# EAGLE design Mono Audio Amp (TPA2005D1) v10 (EAGLE 6.1)
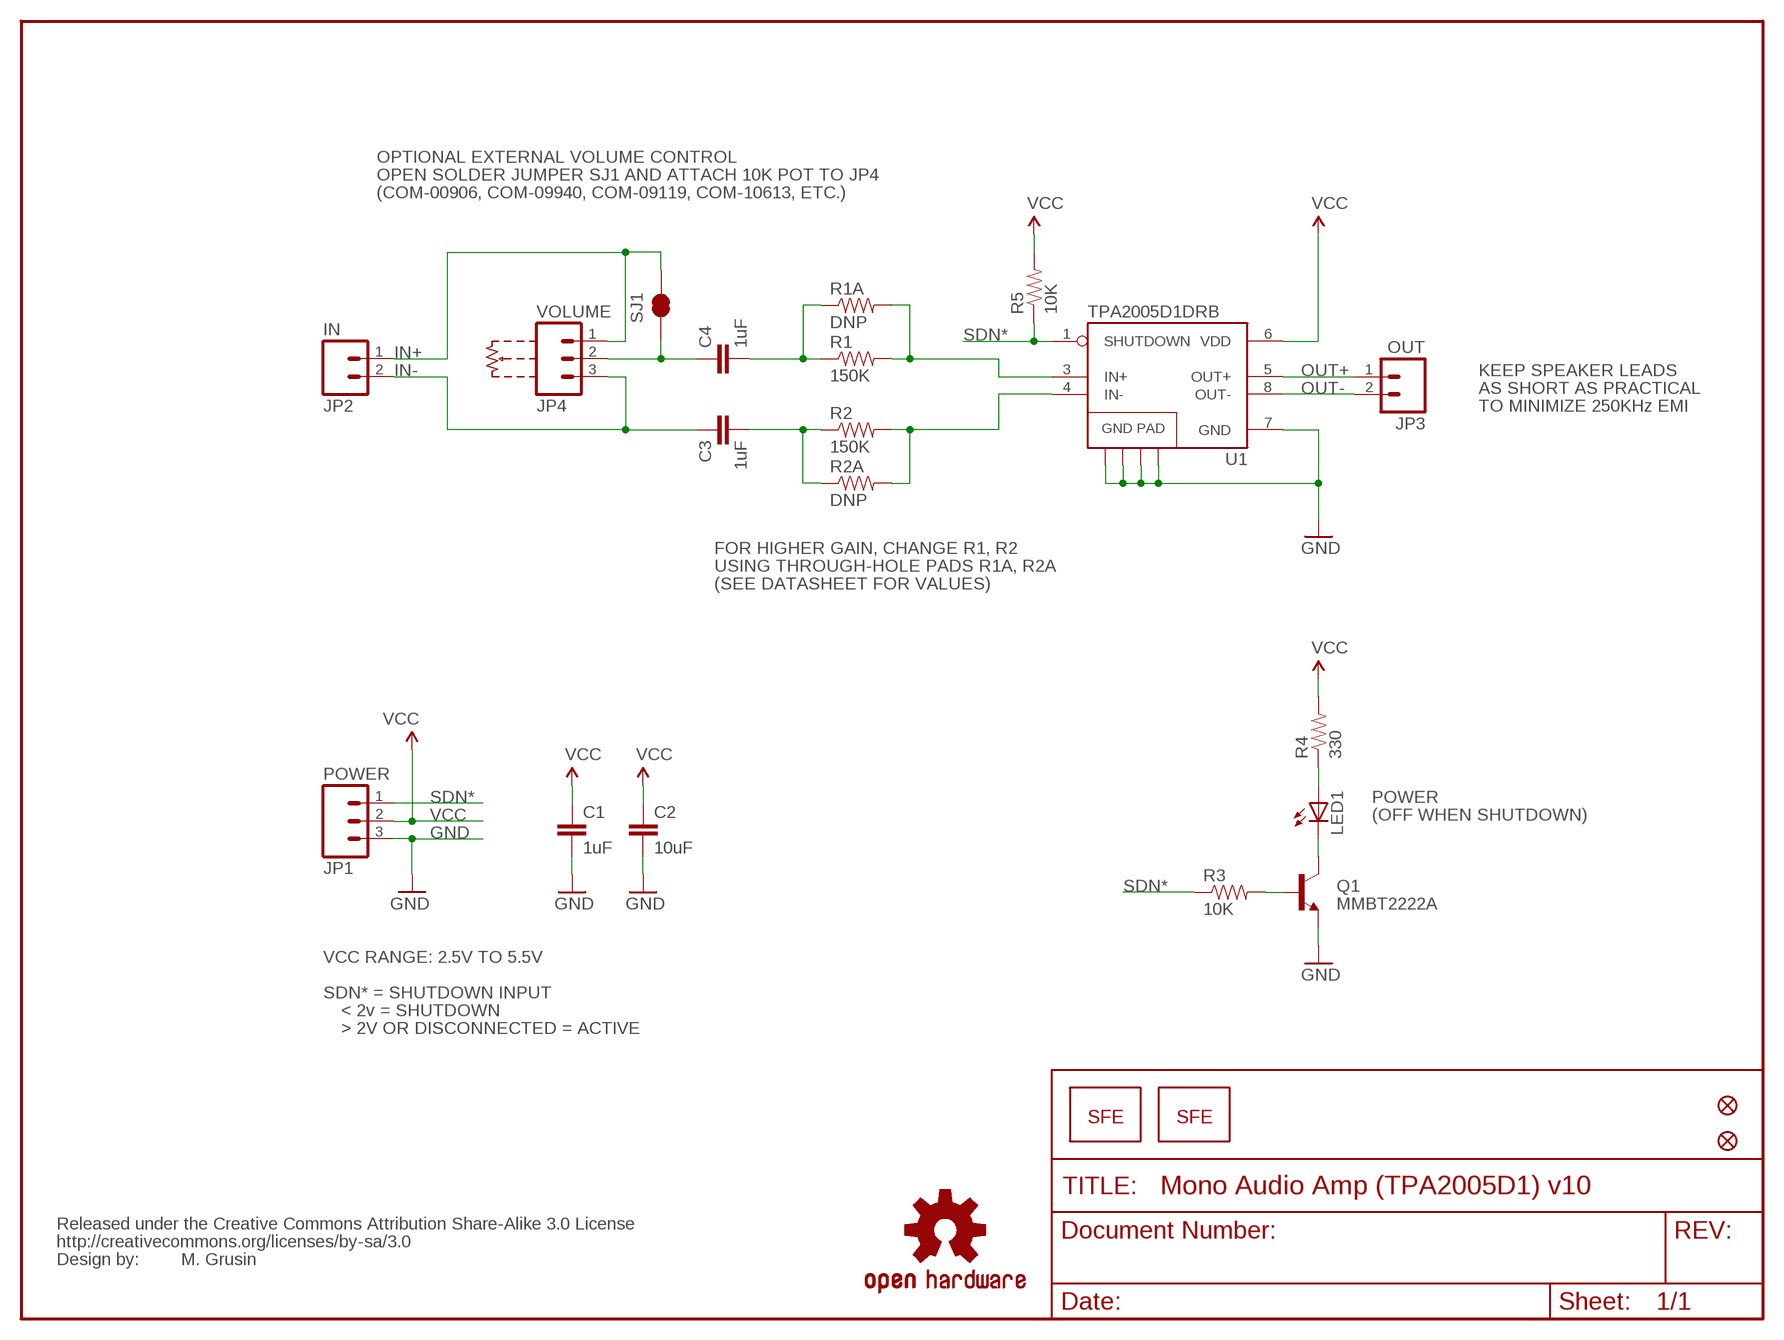
[diagram p0: schematic, sheet 1]

## Parts
C1  1uF  CAP1206  [1206]
C2  10uF  CAP1206  [1206]
C3  1uF  CAP1206  [1206]
C4  1uF  CAP1206  [1206]
JP1  POWER  M03PTH  [1X03]
JP2  IN  M02PTH  [1X02]
JP3  OUT  M02PTH  [1X02]
JP4  VOLUME  M03PTH  [1X03]
JP5  FIDUCIALUFIDUCIAL  [MICRO-FIDUCIAL]
JP6  FIDUCIALUFIDUCIAL  [MICRO-FIDUCIAL]
LED1  LED0603  [LED-0603]
LOGO1  LOGO-SFENW2  [SFE-NEW-WEB]
LOGO2  LOGO-SFESK  [SFE-LOGO-FLAME]
Q1  MMBT2222A  TRANSISTOR_NPNSOT23-3  [SOT23-3]
R1  150K  RESISTOR0603-RES  [0603-RES]
R1A  DNP  RESISTORAXIAL-0.3  [AXIAL-0.3]
R2  150K  RESISTOR0603-RES  [0603-RES]
R2A  DNP  RESISTORAXIAL-0.3  [AXIAL-0.3]
R3  10K  RESISTOR0603-RES  [0603-RES]
R4  330  RESISTOR0603-RES  [0603-RES]
R5  10K  RESISTOR0603-RES  [0603-RES]
SJ1  SOLDERJUMPERNC2  [SJ_2S-NOTRACE]
U1  TPA2005D1DRB  [QFN-8_PAD]
U$1  CREATIVE_COMMONS  [CREATIVE_COMMONS]
U$2  OSHW-LOGOS  [OSHW-LOGO-S]

## Nets
GND: C1.2 C2.2 JP1.3 Q1.2(E) U1.7(GND) U1.10(GND) U1.11(GND) U1.12(GND) U1.13(GND)
IN+: JP2.1 JP4.1 SJ1.2
IN+AMP: R1.2 R1A.P$2 U1.3(IN+)
IN-: C3.1 JP2.2 JP4.3
IN-AMP: R2.2 R2A.P$2 U1.4(IN-)
N$1: C4.1 JP4.2 SJ1.1
N$2: C4.2 R1.1 R1A.P$1
N$3: C3.2 R2.1 R2A.P$1
N$8: LED1.C Q1.3(C)
N$9: LED1.A R4.1
N$10: Q1.1(B) R3.2
OUT+: JP3.1 U1.5(OUT+)
OUT-: JP3.2 U1.8(OUT-)
SDN*: JP1.1 R3.1 R5.1 U1.1(SHUTDOWN)
VCC: C1.1 C2.1 JP1.2 R4.2 R5.2 U1.6(VDD)

## Notes on the sheet
- OPTIONAL EXTERNAL VOLUME CONTROL
- OPEN SOLDER JUMPER SJ1 AND ATTACH 10K POT TO JP4
- (COM-00906, COM-09940, COM-09119, COM-10613, ETC.)
- KEEP SPEAKER LEADS
- AS SHORT AS PRACTICAL
- TO MINIMIZE 250KHz EMI
- FOR HIGHER GAIN, CHANGE R1, R2
- USING THROUGH-HOLE PADS R1A, R2A
- (SEE DATASHEET FOR VALUES)
- POWER
- (OFF WHEN SHUTDOWN)
- VCC RANGE: 2.5V TO 5.5V
- SDN* = SHUTDOWN INPUT
- < 2v = SHUTDOWN
- > 2V OR DISCONNECTED = ACTIVE
- M. Grusin

## Library data of the parts
C1-C4 = SparkFun:CAP: Capacitor Standard 0603 ceramic capacitor, and 0.1" leaded capacitor.
JP1 JP4 = SparkFun:M03: Header 3 Standard 3-pin 0.1" header. Use with straight break away headers (SKU : PRT-00116), right angle break away headers (PRT-00553), swiss pins (PRT-00743), machine pins (PRT-00117), and female headers (PRT-00115). Molex polarized connector foot print use with SKU : PRT-08232 with associated crimp pins and housings.
JP2 JP3 = SparkFun:M02: Header 2 Standard 2-pin 0.1" header. Use with straight break away headers (SKU : PRT-00116), right angle break away headers (PRT-00553), swiss pins (PRT-00743), machine pins (PRT-00117), and female headers (PRT-00115). Molex polarized connector foot print use with SKU : PRT-08233 with associated crimp pins and housings.
JP5 JP6 = SparkFun:FIDUCIAL: Fiducial Alignment Points Various fiducial points for machine vision alignment.
LED1 = SparkFun:LED: LEDs Standard schematic elements and footprints for 5mm, 3mm, 1206, and 0603 sized LEDs. 5mm - Spark Fun Electronics SKU : COM-00529 (and others)
LOGO1 LOGO2 = SparkFun:LOGO-SFE: Spark Fun Electronics PCB Logo This is the standard Spark Fun Electronics PCB logo.
Q1 = SparkFun:TRANSISTOR_NPN: Transistor NPN BJT configuration in SOT23 package. MMBT2222 is the common NPN we use. Double check BCE configuration again layout.
R1 R1A R2 R2A R3-R5 = SparkFun:RESISTOR: Resistor Basic schematic elements and footprints for 0603, 1206, and PTH resistors.
SJ1 = SparkFun:SOLDERJUMPER: Solder Jumper Standard SMD solder jumper. Used to automate production. Two varients : Normally Open and Normally Closed are the same, but have different paste layers. NC will have a large amount of paste and should jumper during reflow.
U1 = mike-temp:TPA2005D1: 1.4W MONO CLASS-D AUDIO POWER AMPLIFIER The TPA2005D1 is a 1.4-W high efficiency filter-free class-D audio power amplifier in a BGA, QFN, or MSOP package that requires only three external components. Datasheet: http://focus.ti.com/lit/ds/symlink/tpa2005d1.pdf 1.4 W Into 8 ? From a 5V Supply at THD = 10% (Typ) Maximum Battery Life and Minimum Heat Efficiency With an 8-? Speaker: 84% at 400 mW, 79% at 100 mW 2.8-mA Quiescent Current 0.5-mA Shutdown Current Ideal for Wireless or Cellular Handsets and PDAs Capable of Driving an 8-? Speaker (2.5 V ? VDD ? 5.5 V) and a 4-? Speaker (2.5 V ? VDD ? 4.2 V) Only Three External Components Optimized PWM Output Stage Eliminates LC Output Filter Internally Generated 250-kHz Switching Frequency Eliminates Capacitor and Resistor Improved PSRR (-71 dB at 217 Hz) and Wide Supply Voltage (2.5 V to 5.5 V) Eliminates Need for a Voltage Regulator Fully Differential Design Reduces RF Rectification and Eliminates Bypass Capacitor Improved CMRR Eliminates Two Input Coupling Capacitors
U$1 = SparkFun:CREATIVE_COMMONS
U$2 = SparkFun:OSHW-LOGO: Open Source Hardware Logo This logo indicates the piece of hardware it is found on incorporates a OSHW license and/or adheres to the definition of open source hardware found here: http://freedomdefined.org/OSHW

## Net classes
0 default: clearance 0.254 mm
1 VCC: width 0.254 mm, clearance 0.254 mm

## Board
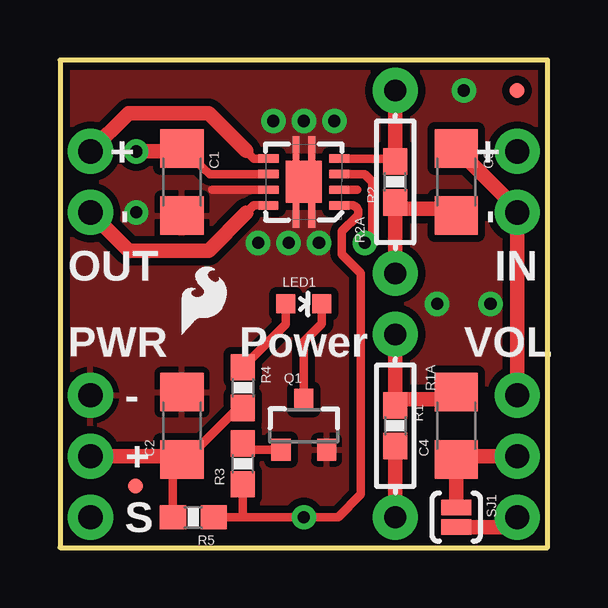
[diagram p1: board, top side]
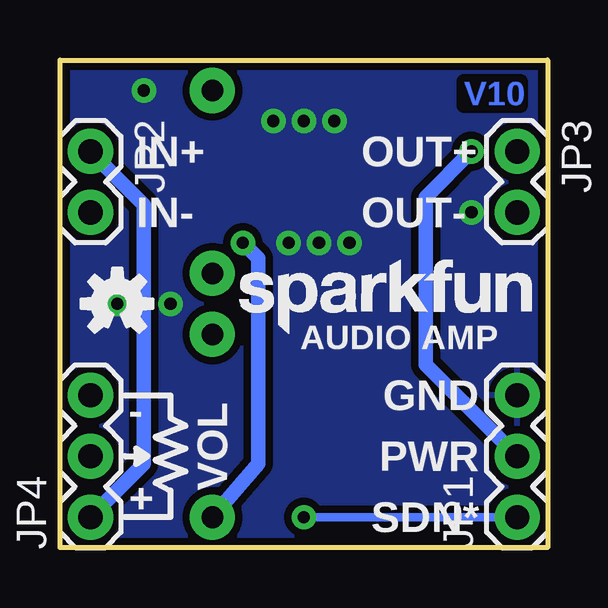
[diagram p2: board, bottom side, seen from below]

Size 20.32 x 20.32 mm. Coordinates in mm from the lower left corner, seen from the top.
Outline: 0,0 20.32,0 20.32,20.32 0,20.32 0,0
Copper layers (1*16): Top 0.035mm / dielectric 1.5mm / Bottom 0.035mm
Design rules: minimum track width 8mil, minimum drill 20mil, track to track 8mil, track to pad 8mil, pad to pad 8mil, via to via 8mil, smd to smd 8mil, copper to edge 8mil, drill to drill 8mil, minimum pad ring 12mil, minimum via ring 10mil, stop-mask expansion 4mil, vias tented up to drill 20mil, thermal gap 10mil

### Footprints (pad centres in the part's own frame; a part is rotated, then mirrored left to right if it is on the bottom)
1206 = smd 1.6 x 1.8: 1 -1.4,0; 2 1.4,0
1X03 = drill 1.016 pad 1.88: 1 0,0; 2 2.54,0; 3 5.08,0
1X02 = drill 1.016 pad 1.88: 1 0,0; 2 2.54,0
MICRO-FIDUCIAL = smd 0.635 x 0.635: 1 0,0
LED-0603 = smd 0.8 x 0.8: A 0,-0.75; C 0,0.75
SOT23-3 = smd 0.8 x 0.9: 1 -0.95,-1; 2 0.95,-1; 3 0,1.1
0603-RES = smd 1.1 x 1: 1 -0.85,0; 2 0.85,0
AXIAL-0.3 = drill 0.9 pad 1.88: P$1 -3.81,0; P$2 3.81,0
SJ_2S-NOTRACE = smd 0.635 x 1.27: 1 -0.401,0; 2 0.413,0
QFN-8_PAD = smd 0.35 x 0.85: 1 -0.975,-1.475; 2 -0.325,-1.475; 3 0.325,-1.475; 4 0.975,-1.475; 5 0.975,1.475; 6 0.325,1.475; 7 -0.325,1.475; 8 -0.975,1.475 | smd 1.75 x 1.5: 9 0,0 | smd 1.025 x 0.28: 10 -1.387,-0.325; 11 1.387,-0.325; 12 1.387,0.325; 13 -1.387,0.325

### Placement (x,y rotation side)
C1  5.08,15.24 270 top
C2  5.08,5.08 90 top
C3  16.51,15.24 270 top
C4  16.51,5.08 90 top
JP1  1.27,1.27 90 bottom
JP2  19.05,16.51 270 bottom
JP3  1.27,16.51 270 bottom
JP4  19.05,1.27 90 bottom
JP5  3.15,2.57 0 top
JP6  19.05,19.05 0 top
LED1  10.16,10.16 270 top
LOGO1  12.86,8.89 0 bottom
LOGO2  5.08,8.89 0 top
Q1  10.16,5.08 0 top
R1  13.97,5.08 270 top
R1A  13.97,5.08 270 top
R2  13.97,15.24 90 top
R2A  13.97,15.24 90 top
R3  7.62,3.49 90 top
R4  7.62,6.67 270 top
R5  5.56,1.27 180 top
SJ1  16.51,1.27 270 top
U1  10.16,15.24 90 top
U$1  -19.05,-11.43 0 top  (outside the outline)
U$2  17.94,10.16 0 bottom

### Tracks (layer width: path | path; a pad name or v marks a point on that pad's centre or on a via)
GND  (via drill 0.51)
  Top 0.356: 6.35,14.91 U1.7
  other vias: 9.53,12.7 11.43,17.78 10.16,17.78 10.79,12.7 3.17,13.97 8.89,17.78 15.72,10.16 16.83,19.05 8.26,12.7 17.94,10.16
  pour Top (isolate 0.305): 0,20.32 20.32,20.32 20.32,0 0,0
  pour Bottom (isolate 0.305): 0,20.32 20.32,20.32 20.32,0 0,0
IN+
  Top 0.61: SJ1.2 19.05,0.86 JP4.1
  Bottom 0.61: JP2.1 16.83,14.29 16.83,3.49 JP4.1
IN+AMP  (via drill 0.51)
  Top 0.356: U1.3 12.69,15.56 13.02,15.24 13.02,12.7 v12.7,12.7
  Top 0.61: R1A.P$2 R1.2
  Bottom 0.61: v12.7,12.7 12.06,12.06 12.06,3.49 R1A.P$2
IN-
  Top 0.356: JP2.2 19.05,14.1
  Top 0.61: JP4.3 JP2.2 | 19.05,14.1 C3.1
IN-AMP
  Top 0.356: U1.4 13.97,16.21 R2.2
  Top 0.61: R2.2 R2A.P$2
N$1
  Top 0.356: C4.1 16.51,3.81
  Top 0.61: SJ1.1 C4.1 | 16.51,3.81 JP4.2
N$2
  Top 0.61: 13.97,6.19 R1.1 13.97,6.19 | 13.97,6.19 R1A.P$1 | 13.97,6.19 16.51,6.19 C4.2
N$3
  Top 0.61: R2A.P$1 13.97,14.13 | 13.97,14.13 R2.1 13.97,14.13 | 13.97,14.13 16.51,14.13 C3.2
N$4
  Top 0.356: 12.38,14.91 11.43,14.91
N$8
  Top 0.356: LED1.C 10.91,9.32 10.16,8.57 Q1.3
N$9
  Top 0.356: LED1.A 9.41,9.31 R4.1
N$10
  Top 0.356: Q1.1 7.62,4.08 R3.2
OUT+
  Top 0.356: U1.5 8.07,16.21 7.76,16.53
  Top 0.61: 7.76,16.53 6.19,18.1 2.86,18.1 JP3.1
OUT-
  Top 0.356: 7.76,13.95 8.07,14.27 U1.8
  Top 0.61: 7.76,13.95 6.19,12.38 2.86,12.38 JP3.2
SDN*  (via drill 0.51)
  Top 0.356: 11.75,14.27 U1.1 12.15,14.27 arc-125 12.38,13.81 11.75,13.18 11.75,12.22 12.54,11.43 12.54,2.22 11.59,1.27 v10.16,1.27 7.62,1.27 | 7.62,1.27 R5.1 | 7.62,1.27 R3.1
  Bottom 0.356: JP1.1 v10.16,1.27
VCC  (via drill 0.51)
  Top 0.356: C2.1 5.08,3.81 | U1.6 6.24,15.56 C1.1 | R4.2 7.41,5.82 5.71,4.13 5.53,4.13 C2.1 | R5.2 4.71,3.68 C2.1
  Top 0.61: 5.08,3.81 JP1.2 | v3.17,16.51 5.08,16.51 C1.1
  Bottom 0.61: JP1.2 5.08,7.62 5.08,14.61 v3.17,16.51

### Text on the board
Bottom: V10
tPlace: + | + | - | - | OUT | IN | PWR | Power | VOL | - | + | S
bPlace: OUT+ | IN+ | OUT- | IN- | AUDIO AMP | GND | - | PWR | SDN* | VOL | +
tValues: M. Grusin
Measures: 0.00" | 0.05" | 0.75" | 0.80" | 0.80" | 0.55" | 0.05" | 0.00"